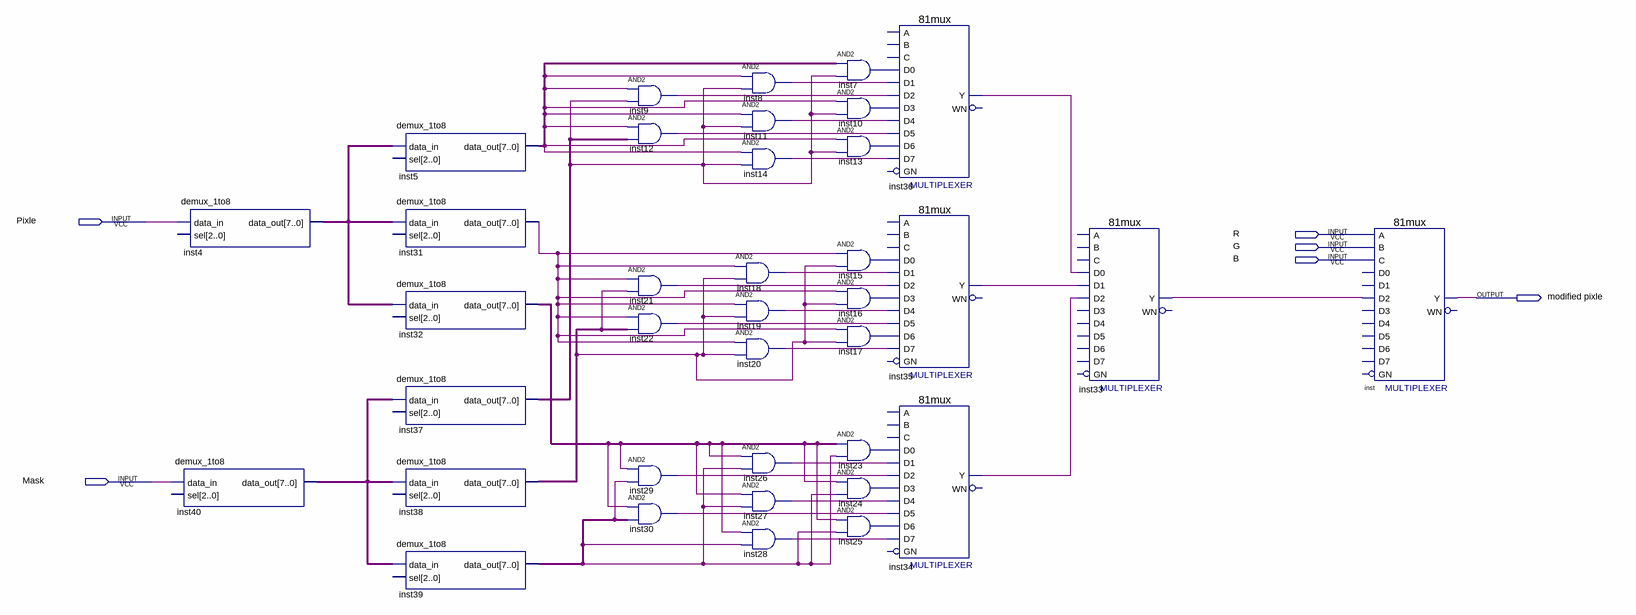
[diagram p0: schematic sheet]
// Quartus schematic Filter.bdf as structural Verilog: 37 symbols, 6 pins
module Filter (
  input  Pixle,
  input  R,
  input  G,
  input  B,
  input  Mask,
  output \modified_pixle 
);

  wire inst7_out, inst8_out, inst9_out, inst10_out, inst11_out, inst12_out, inst13_out, inst14_out,
       inst15_out, inst16_out, inst17_out, inst18_out, inst19_out, inst20_out, inst21_out, inst22_out,
       inst23_out, inst24_out, inst25_out, inst26_out, inst27_out, inst28_out, inst29_out, inst30_out,
       inst31_data_out, inst33_y, inst34_y, inst35_y, inst36_y, undriven, undriven_2, undriven_3, undriven_4,
       undriven_5, undriven_6, undriven_7, undriven_8, undriven_9, undriven_10, undriven_11, undriven_12,
       undriven_13, undriven_14, undriven_15, undriven_16, undriven_17, undriven_18, undriven_19, undriven_20;
  wire [7:0] inst4_data_out, inst5_data_out, inst32_data_out, inst37_data_out, inst38_data_out,
       inst39_data_out, inst40_data_out;

  demux_1to8 inst4 (.data_in(Pixle), .data_out(inst4_data_out));  // open: sel
  demux_1to8 inst40 (.data_in(Mask), .data_out(inst40_data_out));  // open: sel
  demux_1to8 inst5 (.data_in(inst4_data_out), .data_out(inst5_data_out));  // open: sel
  demux_1to8 inst31 (.data_in(inst4_data_out), .data_out(inst31_data_out));  // open: sel
  demux_1to8 inst32 (.data_in(inst4_data_out), .data_out(inst32_data_out));  // open: sel
  demux_1to8 inst37 (.data_in(inst40_data_out), .data_out(inst37_data_out));  // open: sel
  demux_1to8 inst38 (.data_in(inst40_data_out), .data_out(inst38_data_out));  // open: sel
  demux_1to8 inst39 (.data_in(inst40_data_out), .data_out(inst39_data_out));  // open: sel
  and inst9 (inst9_out, undriven_2, undriven_17);
  assign inst12_out = {8{undriven_3}} & inst37_data_out;  // AND2 inst12, 8 bits wide
  and inst21 (inst21_out, inst31_data_out, undriven_19);
  assign inst22_out = {8{inst31_data_out}} & inst38_data_out;  // AND2 inst22, 8 bits wide
  and inst29 (inst29_out, undriven_8, undriven_16);
  assign inst30_out = {8{undriven_11}} & inst39_data_out;  // AND2 inst30, 8 bits wide
  and inst8 (inst8_out, undriven, undriven_20);
  and inst11 (inst11_out, undriven_4, undriven_20);
  and inst14 (inst14_out, undriven_6, undriven_20);
  and inst18 (inst18_out, inst31_data_out, undriven_18);
  and inst19 (inst19_out, inst31_data_out, undriven_18);
  and inst20 (inst20_out, inst31_data_out, undriven_18);
  and inst26 (inst26_out, undriven_7, undriven_15);
  and inst27 (inst27_out, undriven_10, undriven_15);
  and inst28 (inst28_out, undriven_13, undriven_14);
  assign inst7_out = inst5_data_out & {8{undriven_20}};  // AND2 inst7, 8 bits wide
  and inst10 (inst10_out, undriven_5, undriven_20);
  and inst13 (inst13_out, undriven_6, undriven_20);
  and inst15 (inst15_out, inst31_data_out, undriven_18);
  and inst16 (inst16_out, inst31_data_out, undriven_18);
  and inst17 (inst17_out, inst31_data_out, undriven_18);
  assign inst23_out = inst32_data_out & {8{undriven_15}};  // AND2 inst23, 8 bits wide
  and inst24 (inst24_out, undriven_9, undriven_15);
  and inst25 (inst25_out, undriven_12, undriven_15);
  \81mux  inst36 (
    .D1(inst8_out), .D0(inst7_out), .D5(inst12_out), .D4(inst11_out), .D2(inst9_out), .D3(inst10_out),
    .D7(inst14_out), .D6(inst13_out), .Y(inst36_y));  // open: C, GN, A, B, WN
  \81mux  inst35 (
    .D1(inst18_out), .D0(inst15_out), .D5(inst22_out), .D4(inst19_out), .D2(inst21_out), .D3(inst16_out),
    .D7(inst20_out), .D6(inst17_out), .Y(inst35_y));  // open: C, GN, A, B, WN
  \81mux  inst34 (
    .D1(inst26_out), .D0(inst23_out), .D5(inst30_out), .D4(inst27_out), .D2(inst29_out), .D3(inst24_out),
    .D7(inst28_out), .D6(inst25_out), .Y(inst34_y));  // open: C, GN, A, B, WN
  \81mux  inst33 (
    .D1(inst35_y), .D0(inst36_y), .D2(inst34_y), .Y(inst33_y));  // open: C, D5, D4, D3, GN, D7, D6, A, B, WN
  \81mux  inst (.C(B), .D2(inst33_y), .A(R), .B(G), .Y(\modified_pixle ));  // open: D1, D0, D5, D4, D3, GN, D7, D6, WN
endmodule
